# EAGLE schematic vireo (EAGLE 7.3.0)
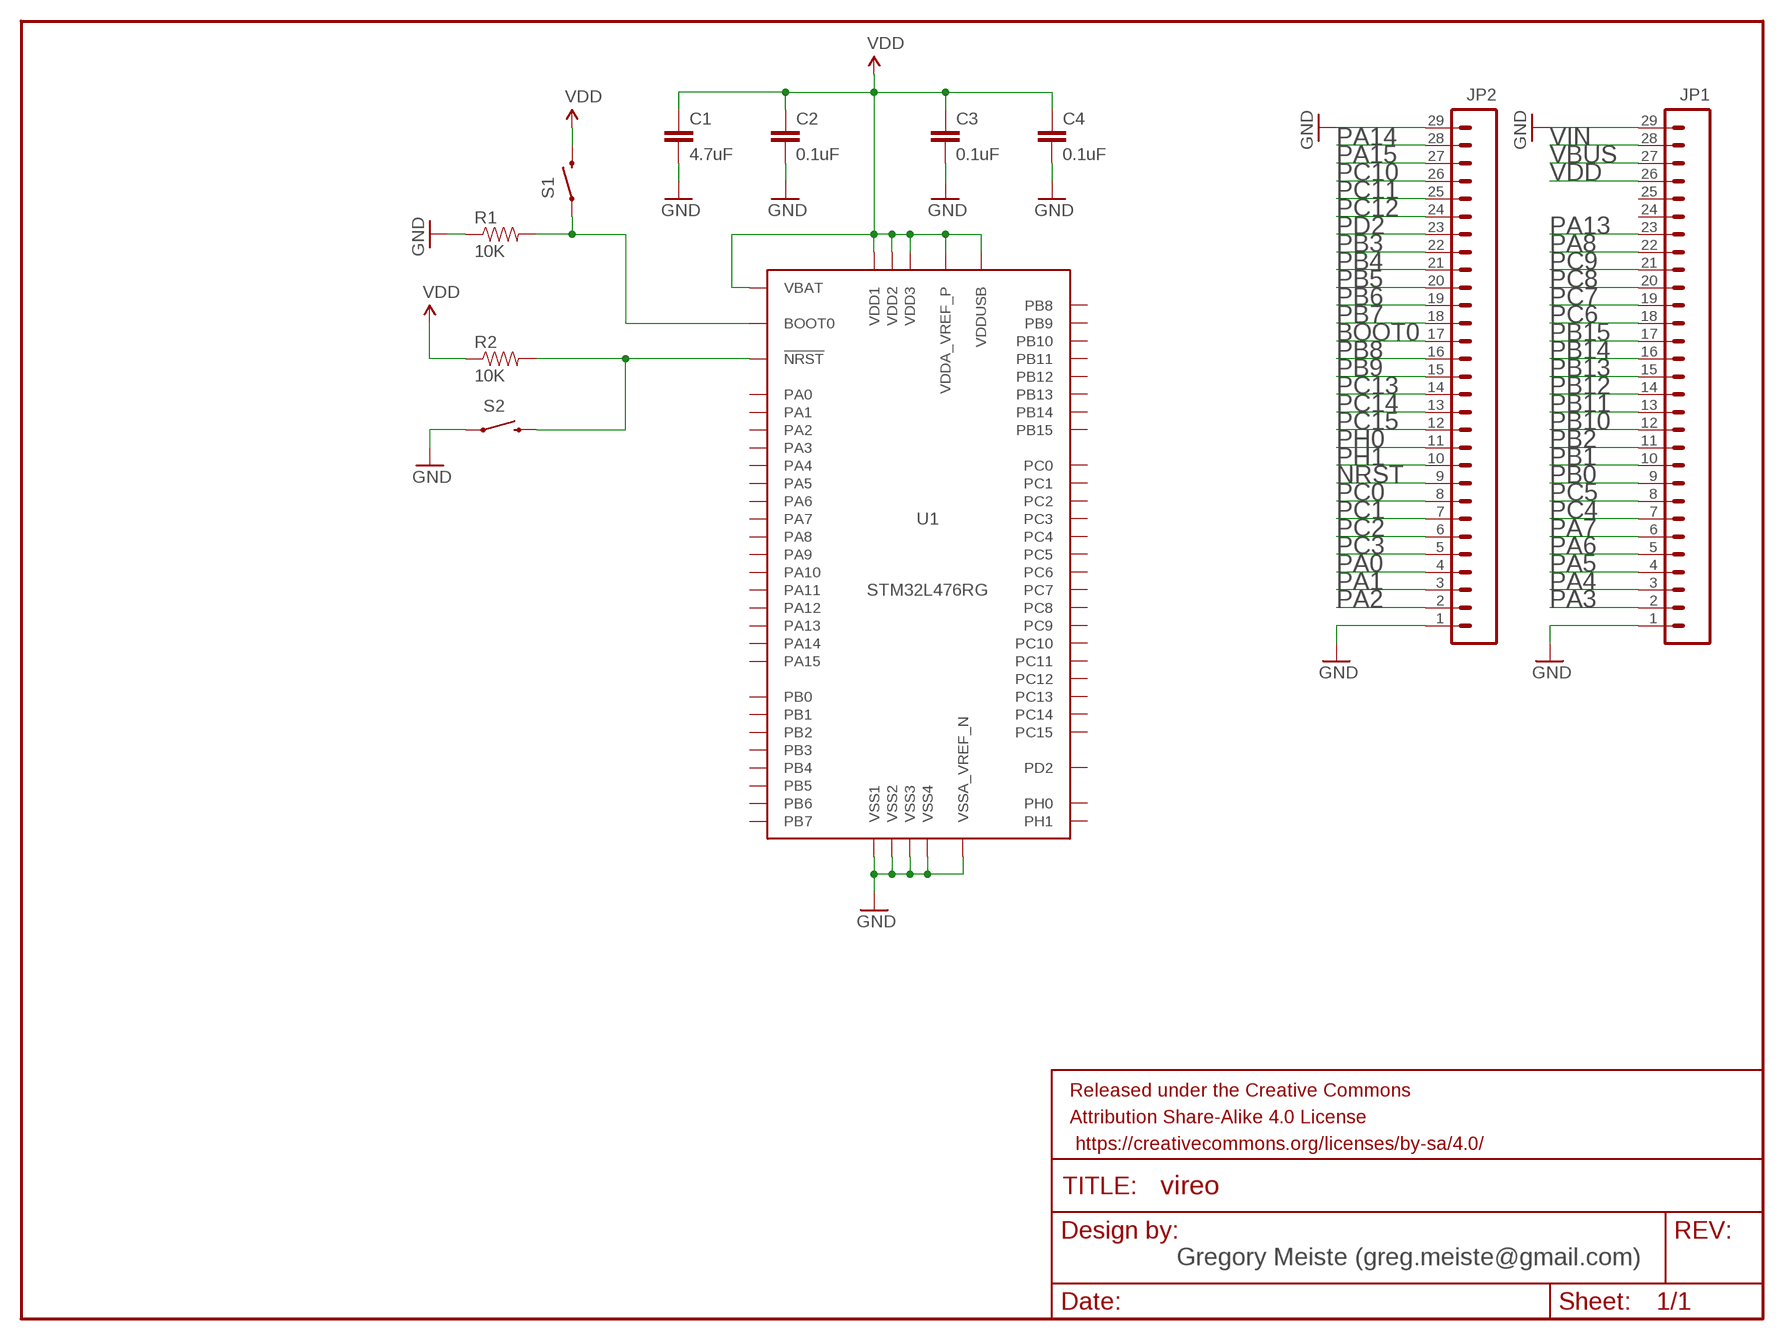
[diagram p0: schematic, sheet 1]

## Parts
C1  4.7uF  CAP0603-CAP  [0603-CAP]
C2  0.1uF  CAP0603-CAP  [0603-CAP]
C3  0.1uF  CAP0603-CAP  [0603-CAP]
C4  0.1uF  CAP0603-CAP  [0603-CAP]
FRAME1  FRAME-LETTER  [CREATIVE_COMMONS]
JP1  M29NO_SILK  [1X29_NO_SILK]
JP2  M29NO_SILK  [1X29_NO_SILK]
R1  10K  RESISTOR0603-RES  [0603-RES]
R2  10K  RESISTOR0603-RES  [0603-RES]
S1  SWITCH-MOMENTARY-2SMD-3  [TACTILE_SWITCH_SMD-3]
S2  SWITCH-MOMENTARY-2SMD-3  [TACTILE_SWITCH_SMD-3]
U1  STM32L476RG  [LQFP64]

## Nets
BOOT0: JP2.17 R1.2 S1.1 U1.60(BOOT0)
GND: C1.2 C2.2 C3.2 C4.2 JP1.1 JP1.29 JP2.1 JP2.29 R1.1 S2.1 U1.12(VSSA_VREF_N) U1.18(VSS1) U1.31(VSS2) U1.47(VSS3) U1.63(VSS4)
NRST: JP2.9 R2.2 S2.4 U1.7(!NRST)
PA0: JP2.4
PA1: JP2.3
PA2: JP2.2
PA3: JP1.2
PA4: JP1.3
PA5: JP1.4
PA6: JP1.5
PA7: JP1.6
PA8: JP1.22
PA13: JP1.23
PA14: JP2.28
PA15: JP2.27
PB0: JP1.9
PB1: JP1.10
PB2: JP1.11
PB3: JP2.22
PB4: JP2.21
PB5: JP2.20
PB6: JP2.19
PB7: JP2.18
PB8: JP2.16
PB9: JP2.15
PB10: JP1.12
PB11: JP1.13
PB12: JP1.14
PB13: JP1.15
PB14: JP1.16
PB15: JP1.17
PC0: JP2.8
PC1: JP2.7
PC2: JP2.6
PC3: JP2.5
PC4: JP1.7
PC5: JP1.8
PC6: JP1.18
PC7: JP1.19
PC8: JP1.20
PC9: JP1.21
PC10: JP2.26
PC11: JP2.25
PC12: JP2.24
PC13: JP2.14
PC14: JP2.13
PC15: JP2.12
PD2: JP2.23
PH0: JP2.11
PH1: JP2.10
VBUS: JP1.27
VDD: C1.1 C2.1 C3.1 C4.1 JP1.26 R2.1 S1.4 U1.1(VBAT) U1.13(VDDA_VREF_P) U1.19(VDD1) U1.32(VDD2) U1.48(VDDUSB) U1.64(VDD3)
VIN: JP1.28
Unconnected: JP1.24 JP1.25 U1.2(PC13) U1.3(PC14) U1.4(PC15) U1.5(PH0) U1.6(PH1) U1.8(PC0) U1.9(PC1) U1.10(PC2) U1.11(PC3) U1.14(PA0) U1.15(PA1) U1.16(PA2) U1.17(PA3) U1.20(PA4) U1.21(PA5) U1.22(PA6) U1.23(PA7) U1.24(PC4) U1.25(PC5) U1.26(PB0) U1.27(PB1) U1.28(PB2) U1.29(PB10) U1.30(PB11) U1.33(PB12) U1.34(PB13) U1.35(PB14) U1.36(PB15) U1.37(PC6) U1.38(PC7) U1.39(PC8) U1.40(PC9) U1.41(PA8) U1.42(PA9) U1.43(PA10) U1.44(PA11) U1.45(PA12) U1.46(PA13) U1.49(PA14) U1.50(PA15) U1.51(PC10) U1.52(PC11) U1.53(PC12) U1.54(PD2) U1.55(PB3) U1.56(PB4) U1.57(PB5) U1.58(PB6) U1.59(PB7) U1.61(PB8) U1.62(PB9)

## Notes on the sheet
- Gregory Meiste (greg.meiste@gmail.com)

## Library data of the parts
C1-C4 = SparkFun-Capacitors:CAP: Capacitor Standard 0603 ceramic capacitor, and 0.1" leaded capacitor.
FRAME1 = SparkFun-Aesthetics:FRAME-LETTER: Schematic Frame Standard 8.5x11 US Letter frame
JP1 JP2 = SparkFun-Connectors:M29: 1x29 .1" header
R1 R2 = SparkFun-Passives:RESISTOR: Resistor Basic schematic elements and footprints for 0603, 1206, and PTH resistors.
S1 S2 = SparkFun-Electromechanical:SWITCH-MOMENTARY-2: Various NO switches- pushbuttons, reed, etc
U1 = vireo:STM32L476R: The STM32L476RG is an ultra-low-power ARM Cortex-M4 with 1MB of flash and 128KB SRAM.